# EAGLE schematic Arduino Electronic Load_Ver07 (EAGLE 7.4.0)
CNAME: Project; CREVISION: 07; DESIGNER: Habid Rascon-Ramos
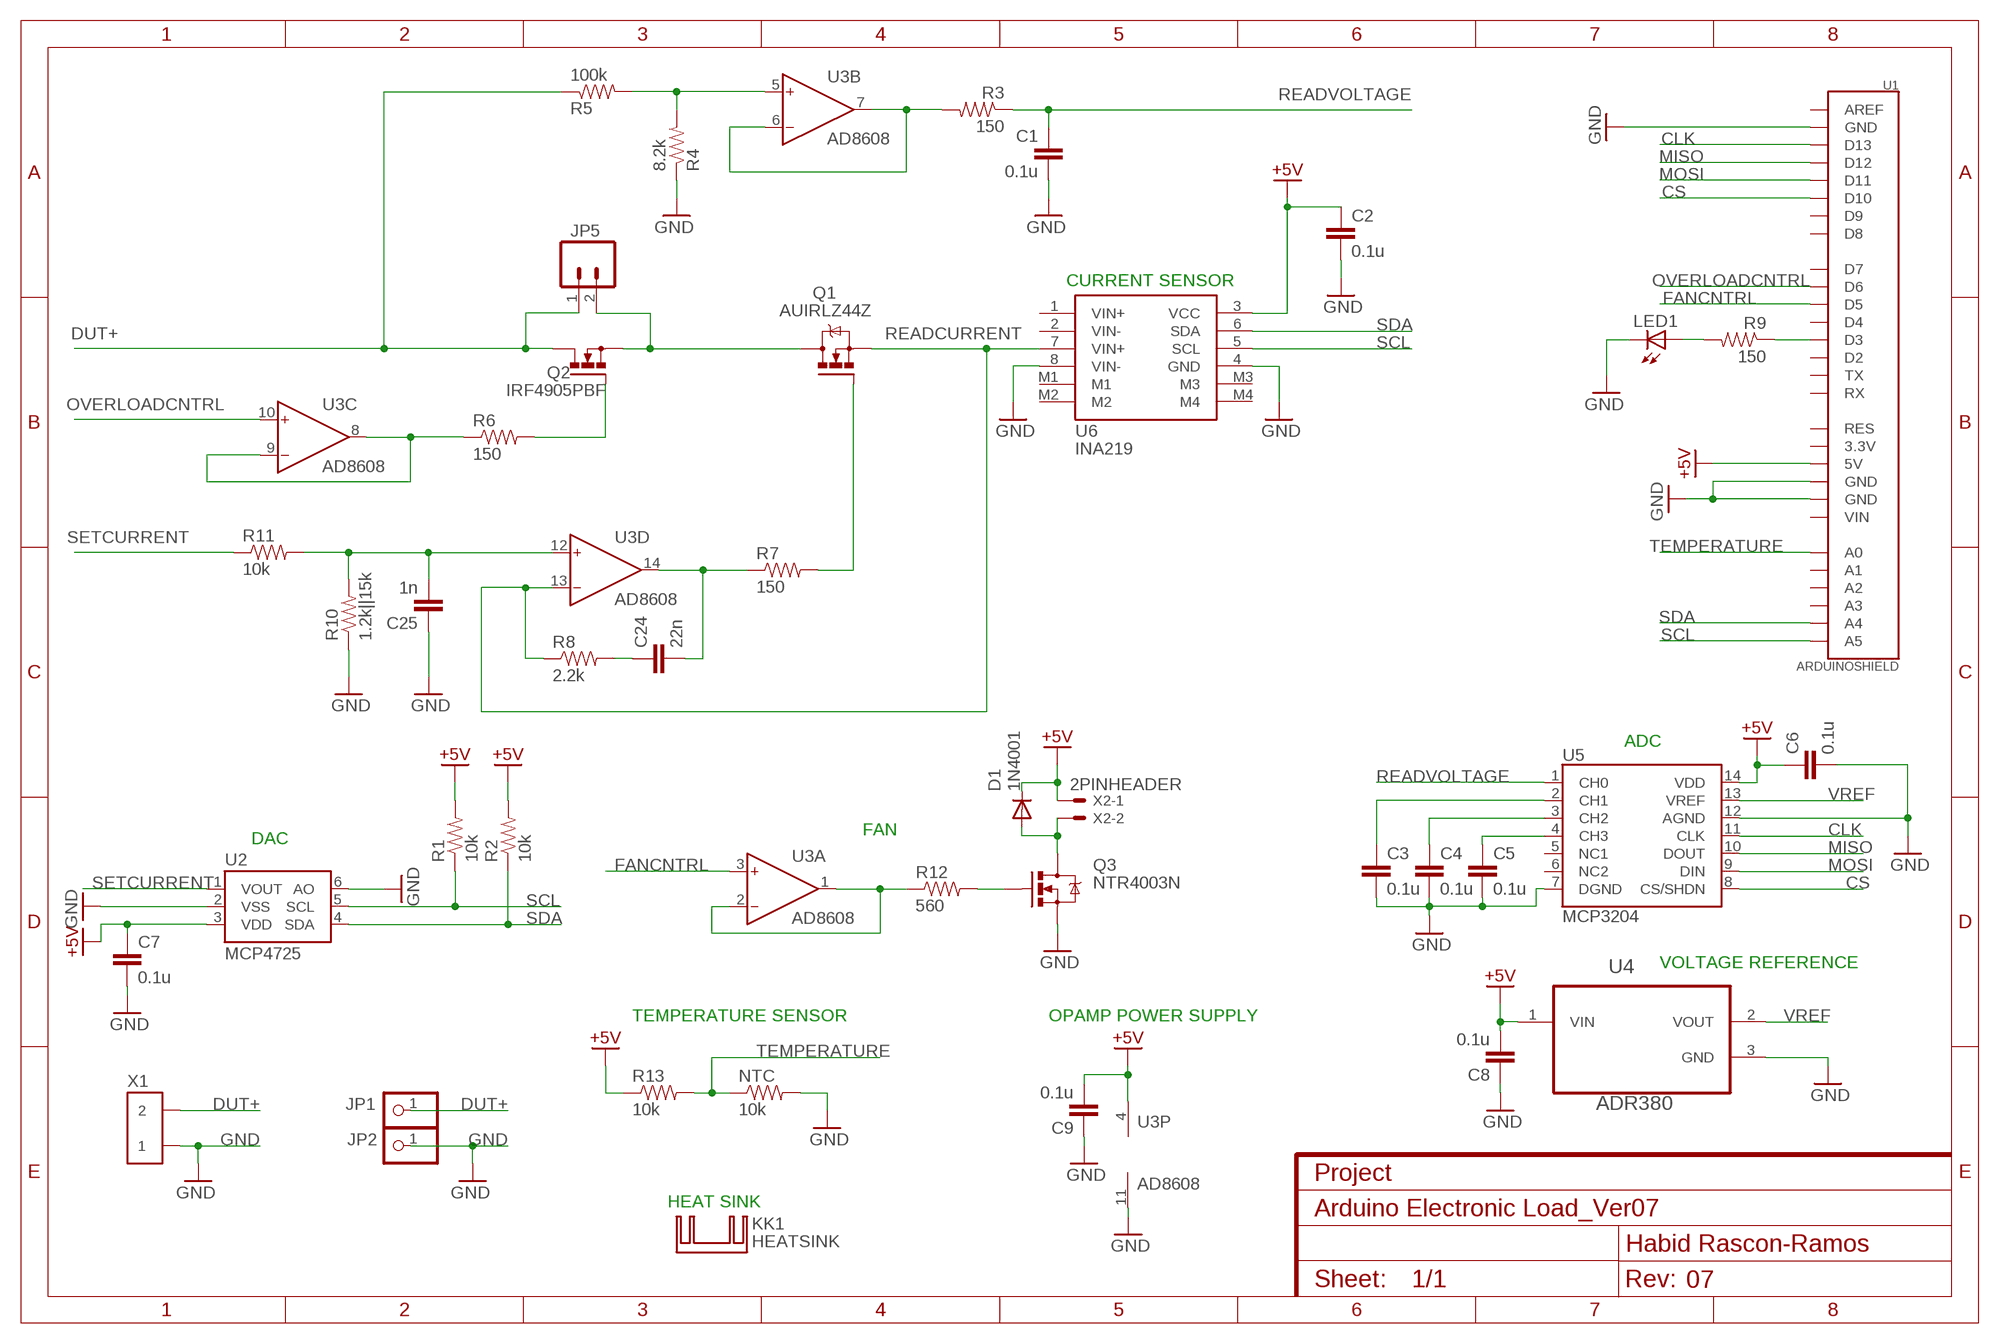
[diagram p0: schematic, sheet 1]

## Parts
C1  0.1u  CAP0603-CAP  [0603-CAP]
C2  0.1u  CAP0603-CAP  [0603-CAP]
C3  0.1u  CAP0603-CAP  [0603-CAP]
C4  0.1u  CAP0603-CAP  [0603-CAP]
C5  0.1u  CAP0603-CAP  [0603-CAP]
C6  0.1u  CAP0603-CAP  [0603-CAP]
C7  0.1u  CAP0603-CAP  [0603-CAP]
C8  0.1u  CAP0603-CAP  [0603-CAP]
C9  0.1u  CAP0603-CAP  [0603-CAP]
C24  22n  CAP0603-CAP  [0603-CAP]
C25  1n  CAP0603-CAP  [0603-CAP]
D1  1N4001  DIODEPTH  [DIODE-1N4001]
JP1  N/A  PINHEAD_PINHD-1X1  [PINHEAD_1X01]
JP2  N/A  PINHEAD_PINHD-1X1  [PINHEAD_1X01]
JP5  2PINHEADER  M02  [1X02_LONGPADS]
KK1  HEATSINK  HEATSINK_SK129  [HEATSINK_SK129-HOLE]
LED1  REDLED  LED5MM  [LED5MM]
NTC  10k  RESISTOR0402-RES  [0402-RES]
Q1  AUIRLZ44Z  IRLZ44Z  [TO220BV_1]
Q2  IRF4905PBF  PMOSFET_NTO220BV  [TO220BV]
Q3  NTR4003N  MOSFET-NCHANNELAO3404A  [SOT23-3]
R1  10k  RESISTOR0603-RES  [0603-RES]
R2  10k  RESISTOR0603-RES  [0603-RES]
R3  150  RESISTOR0603-RES  [0603-RES]
R4  8.2k  RESISTOR0603-RES  [0603-RES]
R5  100k  RESISTOR0603-RES  [0603-RES]
R6  150  RESISTOR0603-RES  [0603-RES]
R7  150  RESISTOR0603-RES  [0603-RES]
R8  2.2k  RESISTOR0603-RES  [0603-RES]
R9  150  RESISTOR0603-RES  [0603-RES]
R10  1.2k||15k  RESISTOR0603-RES  [0603-RES]
R11  10k  RESISTOR0603-RES  [0603-RES]
R12  560  RESISTOR0603-RES  [0603-RES]
R13  10k  RESISTOR0603-RES  [0603-RES]
U1  ARDUINOSHIELD  ARDUINO_SHIELD  [DUEMILANOVE_SHIELD]
U2  MCP4725  MCP4725SOT-23  [SOT23-6]
U3  AD8608  AD8608R  [SO14]
U4  ADR380  ADR380ARTZ-REEL7  [SOT95P237X112-3N]
U5  MCP3204  MCP3204CRZ  [SOIC-14]
U6  INA219  [INA219]
X1  2PINTERMBLOCK  ED350/2  [ED350/2]
X2  2PINHEADER  CON-MOLEX_22-23-2021  [CON-MOLEX_22-23-2021]

## Nets
+5V: C2.1 C6.1 C7.1 C8.2 C9.2 D1.C R1.2 R2.2 R13.1 U1.5V U2.3(VDD) U3.4(P:V+) U4.1(VIN) U5.14(VDD) U6.3(VCC) X2.1
CLK: U1.D13 U5.11(CLK)
CS: U1.D10 U5.8(CS/SHDN)
DUT+: JP1.1 JP5.1 Q2.D R5.1 X1.P$2
FANCNTRL: U1.D5 U3.3(A:IN+)
GND: C1.2 C2.2 C3.2 C4.2 C5.2 C6.2 C7.2 C8.1 C9.1 C25.1 JP2.1 LED1.K(C) NTC.2 Q3.2(S) R4.1 R10.1 U1.GND@0(GND) U1.GND@1(GND) U1.GND@2(GND) U2.2(VSS) U2.6(AO) U3.11(P:V-) U4.3(GND) U5.7(DGND) U5.12(AGND) U6.4(GND) U6.8(VIN-) X1.P$1
MISO: U1.D12 U5.10(DOUT)
MOSI: U1.D11 U5.9(DIN)
N$1: R9.1 U1.D3
N$2: LED1.A R9.2
N$3: R12.1 U3.1(A:OUT) U3.2(A:IN-)
N$4: Q3.1(G) R12.2
N$6: C3.1 U5.2(CH1)
N$7: R3.2 U3.6(B:IN-) U3.7(B:OUT)
N$8: R6.1 U3.8(C:OUT) U3.9(C:IN-)
N$9: R4.2 R5.2 U3.5(B:IN+)
N$10: Q2.G R6.2
N$11: JP5.2 Q1.D Q2.S
N$12: Q1.G R7.2
N$13: C24.2 R7.1 U3.14(D:OUT)
N$14: C4.1 U5.3(CH2)
N$15: C24.1 R8.2
N$16: C5.1 U5.4(CH3)
N$17: C25.2 R10.2 R11.2 U3.12(D:IN+)
N$18: D1.A Q3.3(D) X2.2
OVERLOADCNTRL: U1.D6 U3.10(C:IN+)
READCURRENT: Q1.S R8.1 U3.13(D:IN-) U6.7(VIN+)
READVOLTAGE: C1.1 R3.1 U5.1(CH0)
SCL: R1.1 U1.A5 U2.5(SCL) U6.5(SCL)
SDA: R2.1 U1.A4 U2.4(SDA) U6.6(SDA)
SETCURRENT: R11.1 U2.1(VOUT)
TEMPERATURE: NTC.1 R13.2 U1.A0
VREF: U4.2(VOUT) U5.13(VREF)
Unconnected: U1.3.3V U1.A1 U1.A2 U1.A3 U1.AREF U1.D2 U1.D4 U1.D7 U1.D8 U1.D9 U1.RES U1.RX U1.TX U1.VIN U5.5(NC1) U5.6(NC2) U6.1(VIN+) U6.2(VIN-) U6.M1 U6.M2 U6.M3 U6.M4

## Notes on the sheet
- CURRENT SENSOR
- ADC
- FAN
- DAC
- VOLTAGE REFERENCE
- TEMPERATURE SENSOR | OPAMP POWER SUPPLY
- HEAT SINK

## Library data of the parts
C1-C9 = myLibrary:CAP: Capacitor Standard 0603 ceramic capacitor, and 0.1" leaded capacitor.; DESCRIPTION: CAP CER 0.1UF 16V X7R 0603; MANUFACTURER: Murata Electronics North America; MFG_PART_NUMBER: GRM188R71C104KA01D; PACKAGE: 603; VENDOR: Digi-Key; VENDOR_PART_NUM: 490-1532-1-ND
C24 = myLibrary:CAP: Capacitor Standard 0603 ceramic capacitor, and 0.1" leaded capacitor.; DESCRIPTION: CAP CER 0.022UF 16V X7R 0603; MANUFACTURER: Murata Electronics North America; MFG_PART_NUMBER: GRM188R71C223KA01D; PACKAGE: 603; VENDOR: Digi-Key; VENDOR_PART_NUM: 490-1527-1-ND
C25 = myLibrary:CAP: Capacitor Standard 0603 ceramic capacitor, and 0.1" leaded capacitor.; DESCRIPTION: CAP CER 1000PF 50V X7R 0603; MANUFACTURER: Murata Electronics North America; MFG_PART_NUMBER: GRM188R71H102KA01D; PACKAGE: 603; VENDOR: Digi-Key; VENDOR_PART_NUM: 490-1494-1-ND
D1 = myLibrary:DIODE: Diode These are standard reverse protection diodes and small signal diodes. SMA package can handle up to about 1A. SOD-323 can handle about 200mA. What the SOD-323 package when ordering, there are some mfgs out there that are 5-pin packages.; DESCRIPTION: DIODE GEN PURP 50V 1A DO41; MANUFACTURER: Fairchild Semiconductor; MFG_PART_NUMBER: 1N4001; PACKAGE: DO-41; VENDOR: Digi-Key; VENDOR_PART_NUM: 1N4001FSCT-ND
JP1 JP2 = myLibrary:PINHEAD_PINHD-1X1: PIN HEADER
JP5 = myLibrary:M02: Header 2 Standard 2-pin 0.1" header. Use with straight break away headers (SKU : PRT-00116), right angle break away headers (PRT-00553), swiss pins (PRT-00743), machine pins (PRT-00117), and female headers (PRT-00115). Molex polarized connector foot print use with SKU : PRT-08233 with associated crimp pins and housings.; DESCRIPTION: CONN HEADER VERT SGL 2POS GOLD; MANUFACTURER: 3M; MFG_PART_NUMBER: 961102-6404-AR; PACKAGE: N/A; VENDOR: Digi-Key; VENDOR_PART_NUM: 3M9447-ND
KK1 = myLibrary:HEATSINK_SK129: HEATSINK manufacturer Fischer/distributor Buerklin; DESCRIPTION: HEAT SINK, EXTRUDED, PCB MOUNT; MANUFACTURER: FISCHER ELEKTRONIK; MFG_PART_NUMBER: SK 129 25,4 STS; PACKAGE: N/A; VENDOR: Newark; VENDOR_PART_NUM: 74M4513
LED1 = myLibrary:LED: LEDs Standard schematic elements and footprints for 5mm, 3mm, 1206, and 0603 sized LEDs. 5mm - Spark Fun Electronics SKU : COM-00529 (and others); DESCRIPTION: LED RED DIFF 5MM ROUND T/H; MANUFACTURER: Lite-On Inc.; MFG_PART_NUMBER: LTL2R3KRD-EM; PACKAGE: Radial; VENDOR: Digi-Key; VENDOR_PART_NUM: 160-1853-ND
NTC = myLibrary:RESISTOR: Resistor Basic schematic elements and footprints for 0603, 1206, and PTH 1/10th watt (small) resistors.; DESCRIPTION: THERMISTOR 10K OHM NTC 0402 SMD; MANUFACTURER: Murata Electronics North America; MFG_PART_NUMBER: NCP15XH103F03RC; PACKAGE: 402; VENDOR: Digi-Key; VENDOR_PART_NUM: 490-4801-1-ND
Q1 = myLibrary:IRLZ44Z: N-Channel HEXFET® Power MOSFET Logic Level AUTOMOTIVE MOSFET Source: http://www.irf.com/product-info/datasheets/data/irlz44zpbf.pdf; DESCRIPTION: MOSFET Transistor, N Channel, 51 A, 55 V, TO-220AB; MANUFACTURER: INTERNATIONAL RECTIFIER; MFG_PART_NUMBER: AUIRLZ44Z; PACKAGE: TO-220AB; VENDOR: Newark; VENDOR_PART_NUM: 54T9019
Q2 = myLibrary:PMOSFET_N: Power MOSFET N-Channel; DESCRIPTION: MOSFET P-CH 55V 74A TO-220AB; MANUFACTURER: Infineon Technologies Americas Corp.; MFG_PART_NUMBER: IRF4905PBF; PACKAGE: TO-220AB; VENDOR: Digi-Key; VENDOR_PART_NUM: IRF4905PBF-ND
Q3 = myLibrary:MOSFET-NCHANNEL: Common NMOSFET Parts MFG P/N Store ID Prod ID FDD8780 TRANS-09984 SI7820DN TRANS-11055 FDS6630A IC-08089 2N7002PW TRANS-11151 FQP30N06L COM-10213 TRANS-10060 BSS123LT1G TRANS-08345 BSS138 TRANS-00830 BS170 2N7000; DESCRIPTION: MOSFET N-CH 30V 500MA SOT-23; MANUFACTURER: ON Semiconductor; MFG_PART_NUMBER: NTR4003NT1G; PACKAGE: SOT-23-3; VENDOR: Digi-Key; VENDOR_PART_NUM: NTR4003NT1GOSCT-ND
R1 R2 R11 R13 = myLibrary:RESISTOR: Resistor Basic schematic elements and footprints for 0603, 1206, and PTH 1/10th watt (small) resistors.; DESCRIPTION: RES SMD 10K OHM 1% 1/10W 0603; MANUFACTURER: Yageo; MFG_PART_NUMBER: RC0603FR-0710KL; PACKAGE: 603; VENDOR: Digi-Key; VENDOR_PART_NUM: 311-10.0KHRCT-ND
R3 R6 R7 R9 = myLibrary:RESISTOR: Resistor Basic schematic elements and footprints for 0603, 1206, and PTH 1/10th watt (small) resistors.; DESCRIPTION: RES SMD 150 OHM 1% 1/10W 0603; MANUFACTURER: Yageo; MFG_PART_NUMBER: RC0603FR-07150RL; PACKAGE: 603; VENDOR: Digi-Key; VENDOR_PART_NUM: 311-150HRCT-ND
R4 = myLibrary:RESISTOR: Resistor Basic schematic elements and footprints for 0603, 1206, and PTH 1/10th watt (small) resistors.; DESCRIPTION: RES SMD 8.2K OHM 1% 1/10W 0603; MANUFACTURER: Yageo; MFG_PART_NUMBER: RC0603FR-078K2L; PACKAGE: 603; VENDOR: Digi-Key; VENDOR_PART_NUM: 311-8.20KHRCT-ND
R5 = myLibrary:RESISTOR: Resistor Basic schematic elements and footprints for 0603, 1206, and PTH 1/10th watt (small) resistors.; DESCRIPTION: RES SMD 100K OHM 1% 1/10W 0603; MANUFACTURER: Yageo; MFG_PART_NUMBER: RC0603FR-07100KL; PACKAGE: 603; VENDOR: Digi-Key; VENDOR_PART_NUM: 311-100KHRCT-ND
R8 = myLibrary:RESISTOR: Resistor Basic schematic elements and footprints for 0603, 1206, and PTH 1/10th watt (small) resistors.; DESCRIPTION: RES SMD 2.2K OHM 1% 1/10W 0603; MANUFACTURER: Yageo; MFG_PART_NUMBER: RC0603FR-072K2L; PACKAGE: 603; VENDOR: Digi-Key; VENDOR_PART_NUM: 311-2.20KHRCT-ND
R10 = myLibrary:RESISTOR: Resistor Basic schematic elements and footprints for 0603, 1206, and PTH 1/10th watt (small) resistors.; DESCRIPTION: RES SMD 1.1K OHM 1% 1/10W 0603; MANUFACTURER: Yageo; MFG_PART_NUMBER: RC0603FR-071K1L; PACKAGE: 603; VENDOR: Digi-Key; VENDOR_PART_NUM: 311-1.10KHRCT-ND
R12 = myLibrary:RESISTOR: Resistor Basic schematic elements and footprints for 0603, 1206, and PTH 1/10th watt (small) resistors.; DESCRIPTION: RES SMD 560 OHM 1% 1/10W 0603; MANUFACTURER: Yageo; MFG_PART_NUMBER: RC0603FR-07560RL; PACKAGE: 603; VENDOR: Digi-Key; VENDOR_PART_NUM: 311-560HRCT-ND
U1 = myLibrary:ARDUINO_SHIELD
U2 = myLibrary:MCP4725: Microchip 12-bit I2C DAC, SOT23-6; DESCRIPTION: IC DAC 12BIT W/I2C SOT23A-6; MANUFACTURER: Microchip Technology; MFG_PART_NUMBER: MCP4725A0T-E/CH; PACKAGE: SOT-23-6; VENDOR: Digi-Key; VENDOR_PART_NUM: MCP4725A0T-E/CHCT-ND
U3 = myLibrary:AD8608: Precision, Low Noise, CMOS, Rail-to-Rail, Input/Output Operational Amplifiers http://www.analog.com/static/imported-files/data_sheets/AD8605_8606_8608.pdf; DESCRIPTION: IC OPAMP GP 10MHZ RRO 14TSSOP; MANUFACTURER: Analog Devices Inc.; MFG_PART_NUMBER: AD8608ARUZ-REEL; PACKAGE: 14-TSSOP; VENDOR: Digi-Key; VENDOR_PART_NUM: AD8608ARUZ-REELTR-ND
U4 = myLibrary:ADR380ARTZ-REEL7: Precision Low Drift 2.048 V/2.500 V SOT-23 Voltage Reference; DESCRIPTION: IC VREF SERIES 2.048V SOT23-3; MANUFACTURER: Analog Devices Inc.; MFG_PART_NUMBER: ADR380ARTZ-REEL7; PACKAGE: SOT-23-3; VENDOR: Digi-Key; VENDOR_PART_NUM: ADR380ARTZ-REEL7CT-ND
U5 = myLibrary:MCP3204: IC ADC 12BIT 2.7V 4CH SPI 14SOIC; DESCRIPTION: IC ADC 12BIT 2.7V 4CH SPI 14SOIC; MANUFACTURER: Microchip Technology; MFG_PART_NUMBER: MCP3204-CI/SL; PACKAGE: 14-SOIC; VENDOR: Digi-Key; VENDOR_PART_NUM: MCP3204-CI/SL-ND
U6 = myLibrary:INA219; DESCRIPTION: BREAKOUT INA219 DC SENS 26V 3.2A; MANUFACTURER: Adafruit Industries LLC; MFG_PART_NUMBER: 904; PACKAGE: N/A; VENDOR: Digi-Key; VENDOR_PART_NUM: 1528-1168-ND
X1 = myLibrary:ED350/2: ED350/X (5.0 mm) TERMINAL BLOCK 5MM VERT 2POS PCB Datasheet http://www.on-shore.com/sites/default/files/manuals/edz350.pdf; DESCRIPTION: TERM BLOCK 5.08MM VERT 2POS PCB; MANUFACTURER: On Shore Technology Inc.; MFG_PART_NUMBER: OSTTC022162; PACKAGE: N/A; VENDOR: Digi-Key; VENDOR_PART_NUM: ED2609-ND
X2 = myLibrary:CON-MOLEX_22-23-2021: .100" (2.54mm) Center Header - 2 Pin; DESCRIPTION: CONN HEADER 2POS .100 VERT TIN; MANUFACTURER: Molex, LLC; MFG_PART_NUMBER: 22232021; PACKAGE: N/A; VENDOR: Digi-Key; VENDOR_PART_NUM: WM4200-ND